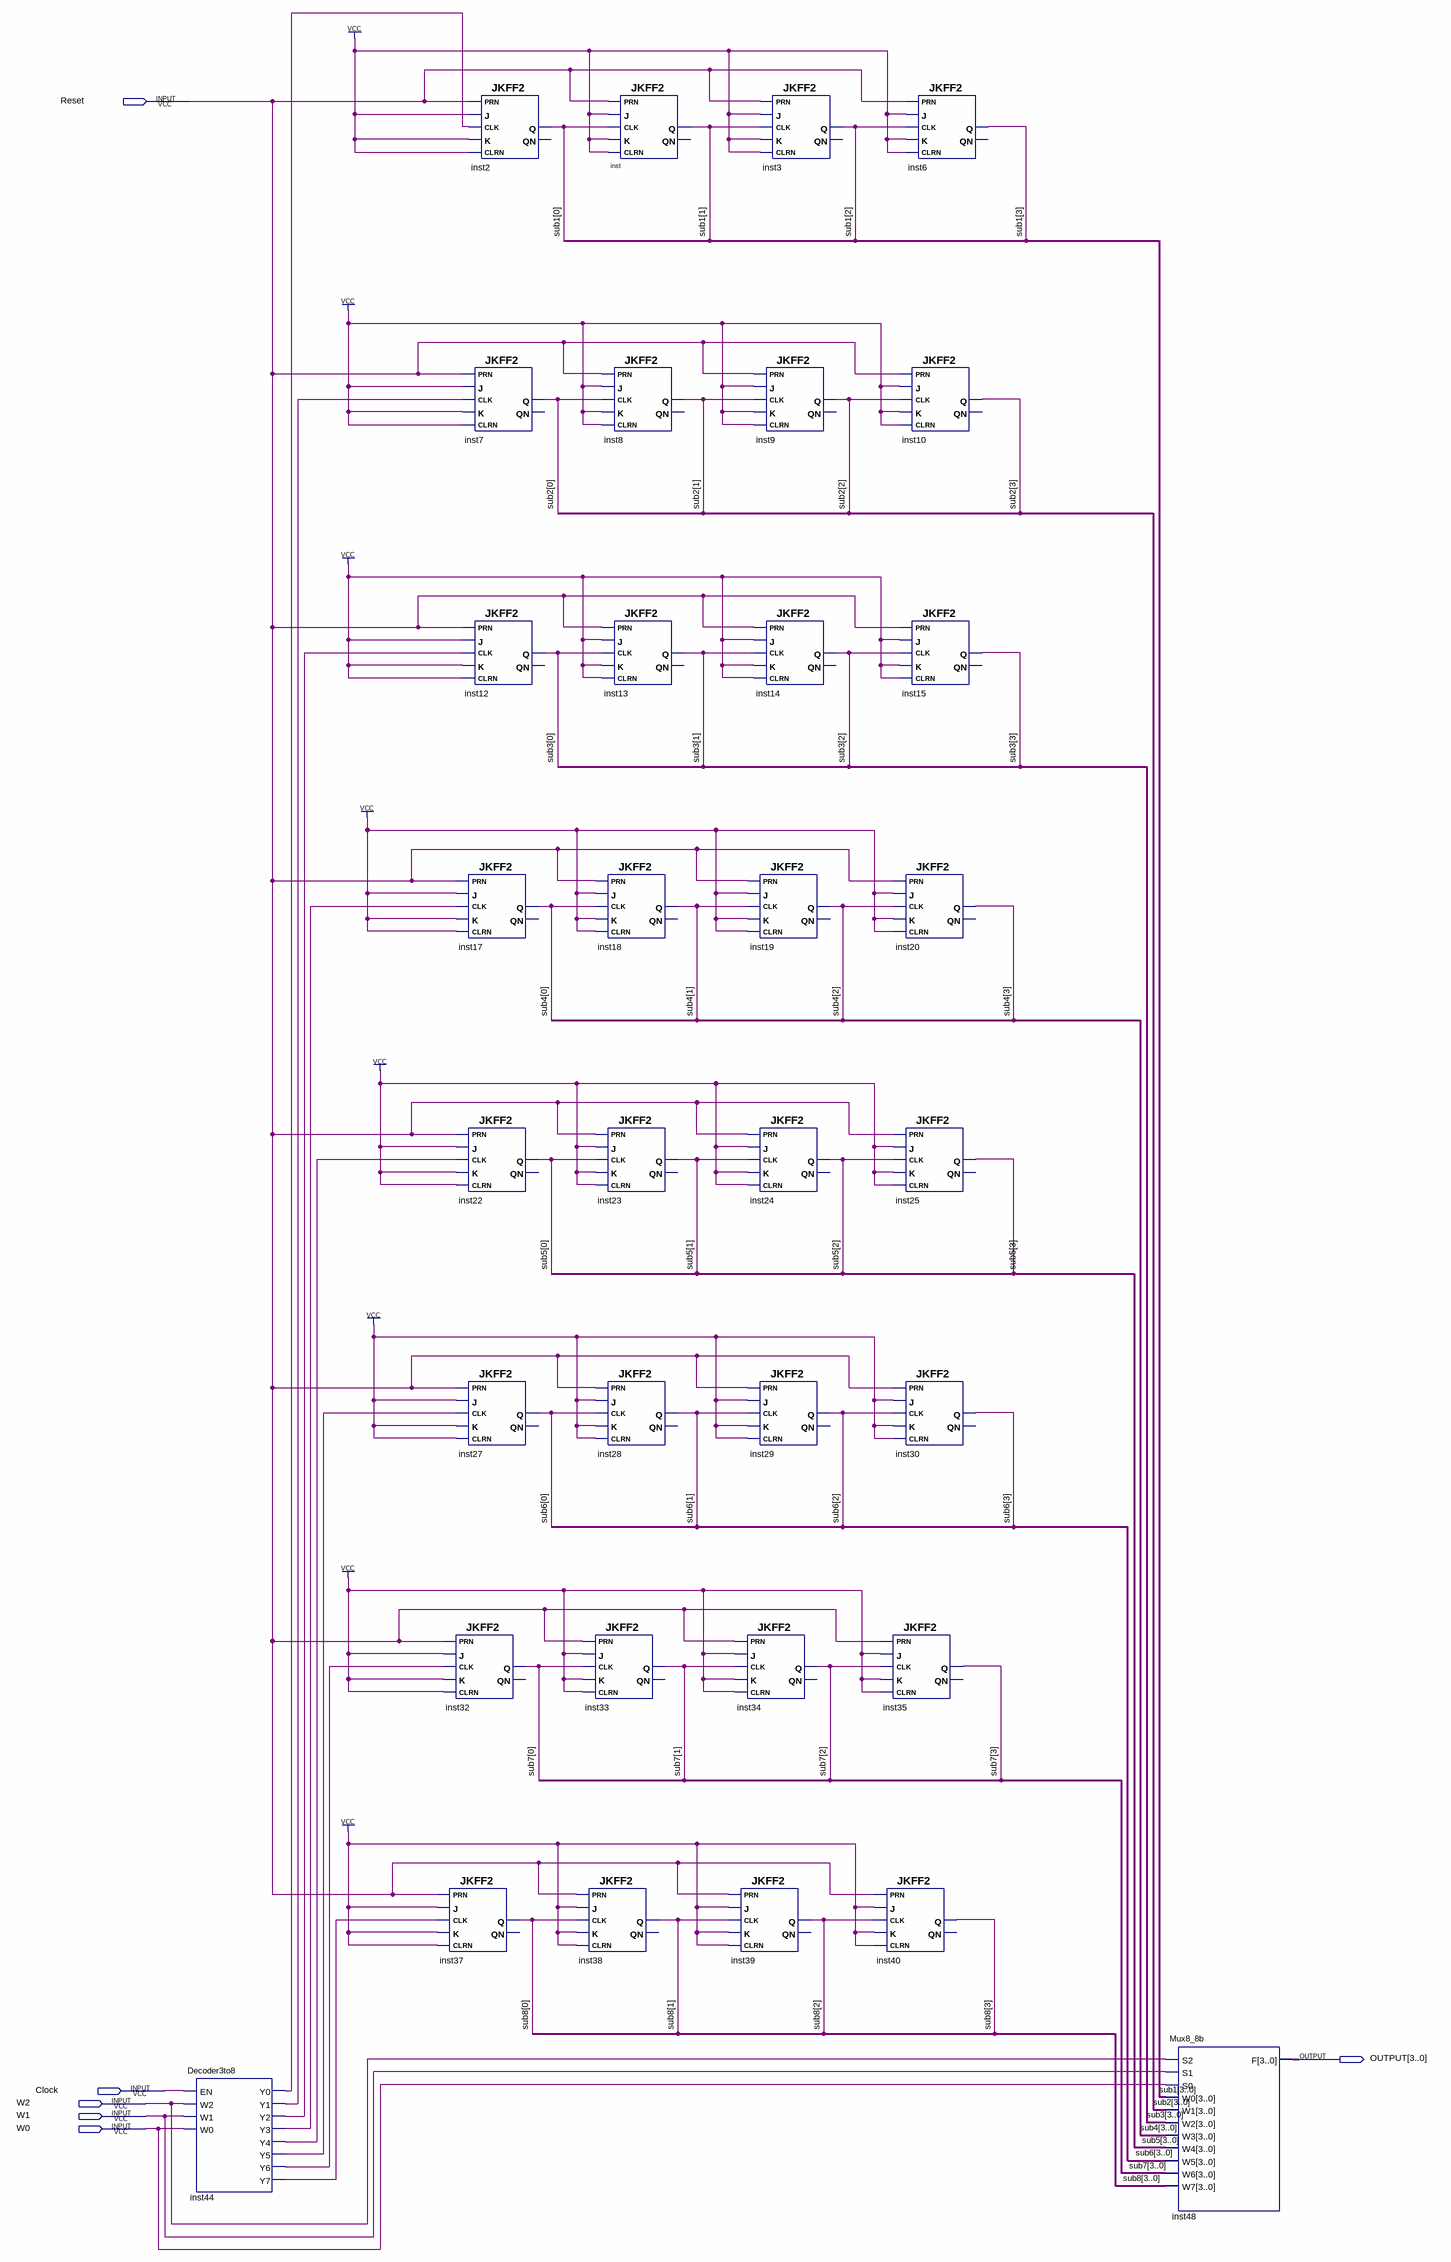
[diagram p0: schematic sheet]
// Quartus schematic subtractor.bdf as structural Verilog: 34 symbols, 6 pins
module subtractor (
  input  Reset,
  input  Clock,
  input  W2,
  input  W1,
  input  W0,
  output [3:0] OUTPUT
);

  wire inst44_y0, inst44_y1, inst44_y2, inst44_y3, inst44_y4, inst44_y5, inst44_y6, inst44_y7;
  wire [3:0] sub1, sub2, sub3, sub4, sub5, sub6, sub7, sub8;

  Decoder3to8 inst44 (
    .EN(Clock), .W2(W2), .W1(W1), .W0(W0), .Y0(inst44_y0), .Y1(inst44_y1), .Y2(inst44_y2), .Y3(inst44_y3),
    .Y4(inst44_y4), .Y5(inst44_y5), .Y6(inst44_y6), .Y7(inst44_y7));
  JKFF2 inst7 (.K(1'b1), .CLRN(1'b1), .CLK(inst44_y1), .PRN(Reset), .J(1'b1), .Q(sub2[0]));  // open: QN
  JKFF2 inst12 (.K(1'b1), .CLRN(1'b1), .CLK(inst44_y2), .PRN(Reset), .J(1'b1), .Q(sub3[0]));  // open: QN
  JKFF2 inst17 (.K(1'b1), .CLRN(1'b1), .CLK(inst44_y3), .PRN(Reset), .J(1'b1), .Q(sub4[0]));  // open: QN
  JKFF2 inst22 (.K(1'b1), .CLRN(1'b1), .CLK(inst44_y4), .PRN(Reset), .J(1'b1), .Q(sub5[0]));  // open: QN
  JKFF2 inst27 (.K(1'b1), .CLRN(1'b1), .CLK(inst44_y5), .PRN(Reset), .J(1'b1), .Q(sub6[0]));  // open: QN
  JKFF2 inst32 (.K(1'b1), .CLRN(1'b1), .CLK(inst44_y6), .PRN(Reset), .J(1'b1), .Q(sub7[0]));  // open: QN
  JKFF2 inst37 (.K(1'b1), .CLRN(1'b1), .CLK(inst44_y7), .PRN(Reset), .J(1'b1), .Q(sub8[0]));  // open: QN
  JKFF2 inst2 (.K(1'b1), .CLRN(1'b1), .CLK(inst44_y0), .PRN(Reset), .J(1'b1), .Q(sub1[0]));  // open: QN
  JKFF2 inst (.K(1'b1), .CLRN(1'b1), .CLK(sub1[0]), .PRN(Reset), .J(1'b1), .Q(sub1[1]));  // open: QN
  JKFF2 inst8 (.K(1'b1), .CLRN(1'b1), .CLK(sub2[0]), .PRN(Reset), .J(1'b1), .Q(sub2[1]));  // open: QN
  JKFF2 inst13 (.K(1'b1), .CLRN(1'b1), .CLK(sub3[0]), .PRN(Reset), .J(1'b1), .Q(sub3[1]));  // open: QN
  JKFF2 inst18 (.K(1'b1), .CLRN(1'b1), .CLK(sub4[0]), .PRN(Reset), .J(1'b1), .Q(sub4[1]));  // open: QN
  JKFF2 inst23 (.K(1'b1), .CLRN(1'b1), .CLK(sub5[0]), .PRN(Reset), .J(1'b1), .Q(sub5[1]));  // open: QN
  JKFF2 inst28 (.K(1'b1), .CLRN(1'b1), .CLK(sub6[0]), .PRN(Reset), .J(1'b1), .Q(sub6[1]));  // open: QN
  JKFF2 inst33 (.K(1'b1), .CLRN(1'b1), .CLK(sub7[0]), .PRN(Reset), .J(1'b1), .Q(sub7[1]));  // open: QN
  JKFF2 inst38 (.K(1'b1), .CLRN(1'b1), .CLK(sub8[0]), .PRN(Reset), .J(1'b1), .Q(sub8[1]));  // open: QN
  JKFF2 inst3 (.K(1'b1), .CLRN(1'b1), .CLK(sub1[1]), .PRN(Reset), .J(1'b1), .Q(sub1[2]));  // open: QN
  JKFF2 inst9 (.K(1'b1), .CLRN(1'b1), .CLK(sub2[1]), .PRN(Reset), .J(1'b1), .Q(sub2[2]));  // open: QN
  JKFF2 inst14 (.K(1'b1), .CLRN(1'b1), .CLK(sub3[1]), .PRN(Reset), .J(1'b1), .Q(sub3[2]));  // open: QN
  JKFF2 inst19 (.K(1'b1), .CLRN(1'b1), .CLK(sub4[1]), .PRN(Reset), .J(1'b1), .Q(sub4[2]));  // open: QN
  JKFF2 inst24 (.K(1'b1), .CLRN(1'b1), .CLK(sub5[1]), .PRN(Reset), .J(1'b1), .Q(sub5[2]));  // open: QN
  JKFF2 inst29 (.K(1'b1), .CLRN(1'b1), .CLK(sub6[1]), .PRN(Reset), .J(1'b1), .Q(sub6[2]));  // open: QN
  JKFF2 inst34 (.K(1'b1), .CLRN(1'b1), .CLK(sub7[1]), .PRN(Reset), .J(1'b1), .Q(sub7[2]));  // open: QN
  JKFF2 inst39 (.K(1'b1), .CLRN(1'b1), .CLK(sub8[1]), .PRN(Reset), .J(1'b1), .Q(sub8[2]));  // open: QN
  JKFF2 inst6 (.K(1'b1), .CLRN(1'b1), .CLK(sub1[2]), .PRN(Reset), .J(1'b1), .Q(sub1[3]));  // open: QN
  JKFF2 inst10 (.K(1'b1), .CLRN(1'b1), .CLK(sub2[2]), .PRN(Reset), .J(1'b1), .Q(sub2[3]));  // open: QN
  JKFF2 inst15 (.K(1'b1), .CLRN(1'b1), .CLK(sub3[2]), .PRN(Reset), .J(1'b1), .Q(sub3[3]));  // open: QN
  JKFF2 inst20 (.K(1'b1), .CLRN(1'b1), .CLK(sub4[2]), .PRN(Reset), .J(1'b1), .Q(sub4[3]));  // open: QN
  JKFF2 inst25 (.K(1'b1), .CLRN(1'b1), .CLK(sub5[2]), .PRN(Reset), .J(1'b1), .Q(sub5[3]));  // open: QN
  JKFF2 inst30 (.K(1'b1), .CLRN(1'b1), .CLK(sub6[2]), .PRN(Reset), .J(1'b1), .Q(sub6[3]));  // open: QN
  JKFF2 inst35 (.K(1'b1), .CLRN(1'b1), .CLK(sub7[2]), .PRN(Reset), .J(1'b1), .Q(sub7[3]));  // open: QN
  JKFF2 inst40 (.K(1'b1), .CLRN(1'b1), .CLK(sub8[2]), .PRN(Reset), .J(1'b1), .Q(sub8[3]));  // open: QN
  Mux8_8b inst48 (
    .S2(W2), .S1(W1), .S0(W0), .W0(sub1), .W1(sub2), .W2(sub3), .W3(sub4), .W4(sub5), .W5(sub6), .W6(sub7),
    .W7(sub8), .F(OUTPUT));
endmodule
